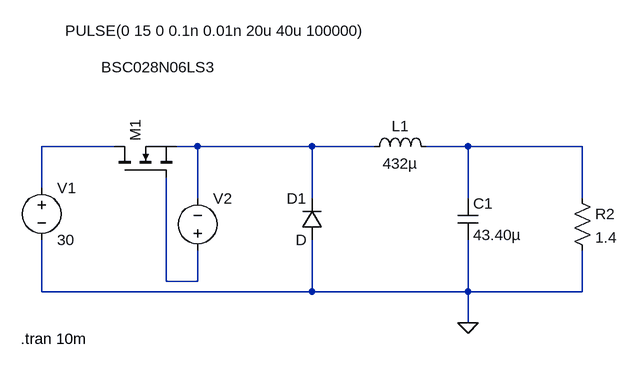
[diagram p0: schematic Buck.asc]
Buck.asc, the LTspice schematic file:
Version 4.1
SHEET 1 968 680
WIRE 48 32 -64 32
WIRE 176 32 144 32
WIRE 352 32 176 32
WIRE 448 32 352 32
WIRE 592 32 528 32
WIRE 768 32 592 32
WIRE -64 96 -64 32
WIRE 176 112 176 32
WIRE 352 112 352 32
WIRE 592 112 592 32
WIRE 768 112 768 32
WIRE 128 240 128 80
WIRE 176 240 176 192
WIRE 176 240 128 240
WIRE -64 256 -64 176
WIRE 352 256 352 176
WIRE 352 256 -64 256
WIRE 592 256 592 176
WIRE 592 256 352 256
WIRE 768 256 768 192
WIRE 768 256 592 256
WIRE 592 304 592 256
FLAG 592 304 0
SYMBOL cap 576 112 R0
SYMATTR InstName C1
SYMATTR Value 43.40µ
SYMBOL ind 432 48 R270
WINDOW 0 32 56 VTop 2
WINDOW 3 5 56 VBottom 2
SYMATTR InstName L1
SYMATTR Value 432µ
SYMBOL diode 368 176 R180
WINDOW 0 24 64 Left 2
WINDOW 3 24 0 Left 2
SYMATTR InstName D1
SYMBOL voltage -64 80 R0
WINDOW 123 0 0 Left 0
WINDOW 39 0 0 Left 0
SYMATTR InstName V1
SYMATTR Value 30
SYMBOL res 752 96 R0
SYMATTR InstName R2
SYMATTR Value 1.4
SYMBOL nmos 48 80 R270
WINDOW 3 170 -20 VRight 2
SYMATTR Value BSC028N06LS3
SYMATTR InstName M1
SYMBOL voltage 176 208 M180
WINDOW 0 24 96 Left 2
WINDOW 3 -204 354 Left 2
WINDOW 123 0 0 Left 0
WINDOW 39 0 0 Left 0
SYMATTR InstName V2
SYMATTR Value PULSE(0 15 0 0.1n 0.01n 20u 40u 100000)
TEXT -96 328 Left 2 !.tran 10m

The netlist it stands for:
* Buck.asc
C1 N003 0 43.40µ
L1 N002 N003 432µ
D1 0 N002 D
V1 N001 0 30
R2 N003 0 1.4
M1 N001 N004 N002 N002 BSC028N06LS3
V2 N004 N002 PULSE(0 15 0 0.1n 0.01n 20u 40u 100000)
.model D D
.lib standard.dio
.model NMOS NMOS
.model PMOS PMOS
.lib standard.mos
.tran 10m
.backanno
.end